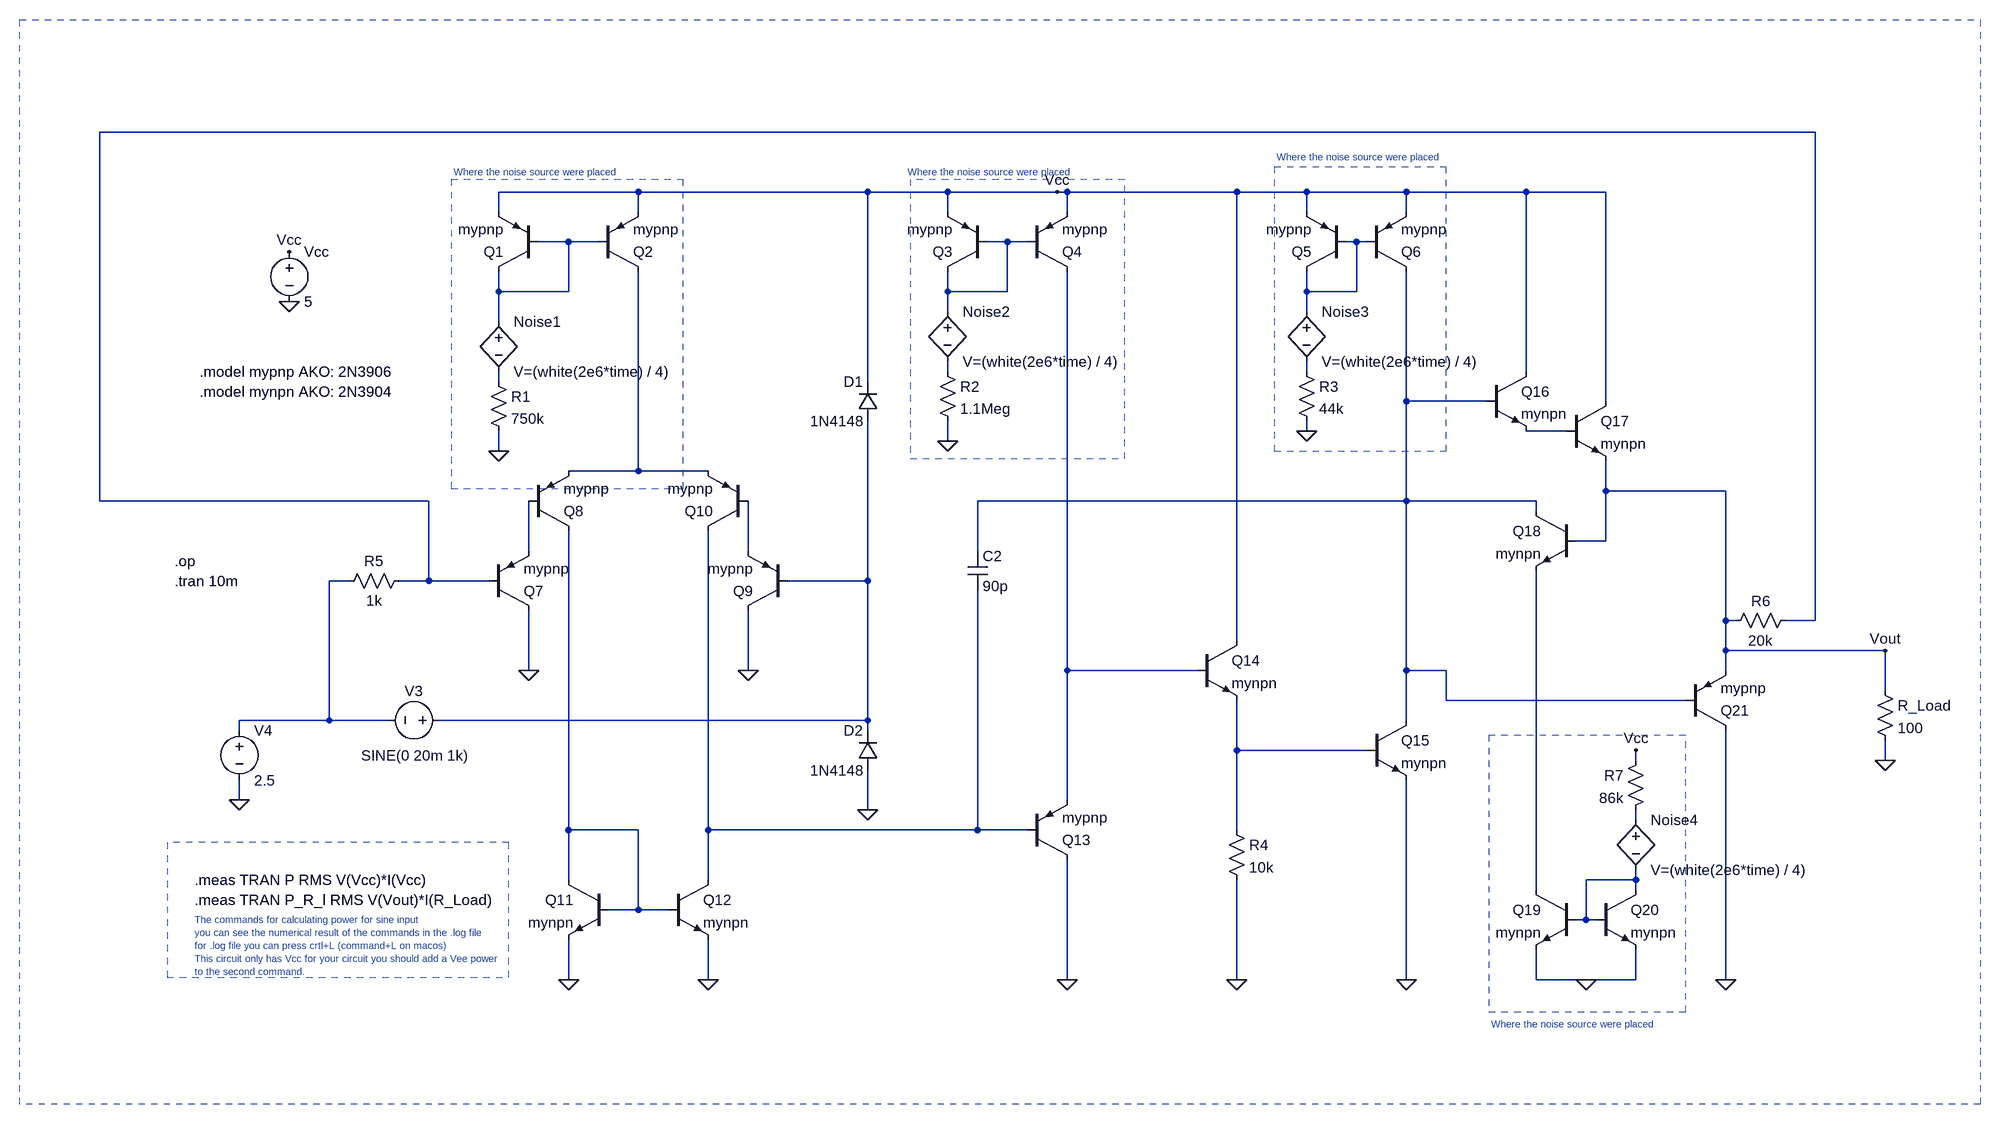
[diagram p0: schematic Noise&Power_Example.asc]
Noise&Power_Example.asc, the LTspice schematic file:
Version 4
SHEET 1 2320 1292
WIRE 1552 -272 -1200 -272
WIRE -336 -176 -560 -176
WIRE 32 -176 -336 -176
WIRE 160 -176 32 -176
WIRE 336 -176 160 -176
WIRE 352 -176 336 -176
WIRE 624 -176 352 -176
WIRE 736 -176 624 -176
WIRE 896 -176 736 -176
WIRE 1088 -176 896 -176
WIRE 1216 -176 1088 -176
WIRE -560 -144 -560 -176
WIRE -336 -144 -336 -176
WIRE 160 -144 160 -176
WIRE 352 -144 352 -176
WIRE 736 -144 736 -176
WIRE 896 -144 896 -176
WIRE -448 -96 -496 -96
WIRE -400 -96 -448 -96
WIRE 256 -96 224 -96
WIRE 288 -96 256 -96
WIRE 816 -96 800 -96
WIRE 832 -96 816 -96
WIRE -560 -16 -560 -48
WIRE -448 -16 -448 -96
WIRE -448 -16 -560 -16
WIRE 160 -16 160 -48
WIRE 256 -16 256 -96
WIRE 256 -16 160 -16
WIRE 736 -16 736 -48
WIRE 816 -16 816 -96
WIRE 816 -16 736 -16
WIRE 160 16 160 -16
WIRE 736 16 736 -16
WIRE -560 32 -560 -16
WIRE 160 112 160 96
WIRE 736 112 736 96
WIRE 1088 112 1088 -176
WIRE -560 128 -560 112
WIRE 32 128 32 -176
WIRE 896 160 896 -48
WIRE 1024 160 896 160
WIRE 1216 160 1216 -176
WIRE 736 208 736 192
WIRE 1152 208 1088 208
WIRE 160 224 160 192
WIRE -560 240 -560 208
WIRE -336 272 -336 -48
WIRE -336 272 -448 272
WIRE -224 272 -336 272
WIRE 1216 304 1216 256
WIRE 1408 304 1216 304
WIRE -1200 320 -1200 -272
WIRE -672 320 -1200 320
WIRE 896 320 896 160
WIRE 896 320 208 320
WIRE 1104 320 896 320
WIRE 1104 336 1104 320
WIRE 1216 384 1216 304
WIRE 1216 384 1168 384
WIRE -512 400 -512 320
WIRE -160 400 -160 320
WIRE 208 400 208 320
WIRE -800 448 -832 448
WIRE -672 448 -672 320
WIRE -672 448 -720 448
WIRE -576 448 -672 448
WIRE 32 448 32 192
WIRE 32 448 -96 448
WIRE 1408 512 1408 304
WIRE 1424 512 1408 512
WIRE 1552 512 1552 -272
WIRE 1552 512 1504 512
WIRE 624 544 624 -176
WIRE 1408 560 1408 512
WIRE 1664 560 1408 560
WIRE -512 592 -512 496
WIRE -160 592 -160 496
WIRE 352 592 352 -48
WIRE 560 592 352 592
WIRE 896 592 896 320
WIRE 960 592 896 592
WIRE 1408 592 1408 560
WIRE 1664 624 1664 560
WIRE 960 640 960 592
WIRE 1344 640 960 640
WIRE -832 672 -832 448
WIRE -832 672 -976 672
WIRE -736 672 -832 672
WIRE 32 672 32 448
WIRE 32 672 -656 672
WIRE 896 672 896 592
WIRE -976 688 -976 672
WIRE 32 688 32 672
WIRE 624 720 624 640
WIRE 832 720 624 720
WIRE 1264 736 1264 720
WIRE 1664 736 1664 704
WIRE -976 800 -976 768
WIRE 352 800 352 592
WIRE 32 816 32 752
WIRE 1264 832 1264 816
WIRE -448 848 -448 368
WIRE -336 848 -448 848
WIRE -224 848 -224 368
WIRE 208 848 208 464
WIRE 208 848 -224 848
WIRE 288 848 208 848
WIRE 624 848 624 720
WIRE -448 928 -448 848
WIRE -224 928 -224 848
WIRE 1264 928 1264 912
WIRE 1264 928 1184 928
WIRE 1104 944 1104 432
WIRE 1264 944 1264 928
WIRE -336 976 -336 848
WIRE -336 976 -384 976
WIRE -288 976 -336 976
WIRE 1184 992 1184 928
WIRE 1184 992 1168 992
WIRE 1200 992 1184 992
WIRE -448 1088 -448 1024
WIRE -224 1088 -224 1024
WIRE 352 1088 352 896
WIRE 624 1088 624 928
WIRE 896 1088 896 768
WIRE 1104 1088 1104 1040
WIRE 1184 1088 1104 1088
WIRE 1264 1088 1264 1040
WIRE 1264 1088 1184 1088
WIRE 1408 1088 1408 688
FLAG -896 0 0
FLAG -896 -80 Vcc
FLAG 336 -176 Vcc
FLAG -560 240 0
FLAG 160 224 0
FLAG 736 208 0
FLAG -512 592 0
FLAG -160 592 0
FLAG -448 1088 0
FLAG -224 1088 0
FLAG 352 1088 0
FLAG 624 1088 0
FLAG 896 1088 0
FLAG 32 816 0
FLAG -976 800 0
FLAG 1264 720 Vcc
FLAG 1184 1088 0
FLAG 1664 736 0
FLAG 1664 560 Vout
FLAG 1408 1088 0
SYMBOL voltage -896 -96 R0
SYMATTR InstName Vcc
SYMATTR Value 5
SYMBOL diode 48 192 R180
WINDOW 0 24 64 Left 2
WINDOW 3 24 0 Left 2
SYMATTR InstName D1
SYMATTR Value 1N4148
SYMBOL pnp -496 -48 R180
SYMATTR InstName Q1
SYMATTR Value mypnp
SYMBOL pnp -400 -48 M180
SYMATTR InstName Q2
SYMATTR Value mypnp
SYMBOL res -576 112 R0
SYMATTR InstName R1
SYMATTR Value 750k
SYMBOL pnp 224 -48 R180
SYMATTR InstName Q3
SYMATTR Value mypnp
SYMBOL pnp 288 -48 M180
SYMATTR InstName Q4
SYMATTR Value mypnp
SYMBOL res 144 96 R0
SYMATTR InstName R2
SYMATTR Value 1.1Meg
SYMBOL pnp 800 -48 R180
SYMATTR InstName Q5
SYMATTR Value mypnp
SYMBOL pnp 832 -48 M180
SYMATTR InstName Q6
SYMATTR Value mypnp
SYMBOL res 720 96 R0
SYMATTR InstName R3
SYMATTR Value 44k
SYMBOL pnp -576 496 M180
SYMATTR InstName Q7
SYMATTR Value mypnp
SYMBOL pnp -512 368 M180
SYMATTR InstName Q8
SYMATTR Value mypnp
SYMBOL pnp -96 496 R180
SYMATTR InstName Q9
SYMATTR Value mypnp
SYMBOL pnp -160 368 R180
SYMATTR InstName Q10
SYMATTR Value mypnp
SYMBOL npn -384 928 M0
SYMATTR InstName Q11
SYMATTR Value mynpn
SYMBOL npn -288 928 R0
SYMATTR InstName Q12
SYMATTR Value mynpn
SYMBOL pnp 288 896 M180
SYMATTR InstName Q13
SYMATTR Value mypnp
SYMBOL npn 560 544 R0
SYMATTR InstName Q14
SYMATTR Value mynpn
SYMBOL res 608 832 R0
SYMATTR InstName R4
SYMATTR Value 10k
SYMBOL npn 832 672 R0
SYMATTR InstName Q15
SYMATTR Value mynpn
SYMBOL diode 48 752 R180
WINDOW 0 24 64 Left 2
WINDOW 3 24 0 Left 2
SYMATTR InstName D2
SYMATTR Value 1N4148
SYMBOL cap 192 400 R0
SYMATTR InstName C2
SYMATTR Value 90p
SYMBOL res -704 432 R90
WINDOW 0 0 56 VBottom 2
WINDOW 3 32 56 VTop 2
SYMATTR InstName R5
SYMATTR Value 1k
SYMBOL res 1520 496 R90
WINDOW 0 0 56 VBottom 2
WINDOW 3 32 56 VTop 2
SYMATTR InstName R6
SYMATTR Value 20k
SYMBOL voltage -640 672 R90
WINDOW 0 -32 56 VBottom 2
WINDOW 3 72 55 VBottom 2
SYMATTR InstName V3
SYMATTR Value SINE(0 20m 1k)
SYMATTR Value2 AC -1m
SYMBOL voltage -976 672 R0
SYMATTR InstName V4
SYMATTR Value 2.5
SYMBOL npn 1024 112 R0
SYMATTR InstName Q16
SYMATTR Value mynpn
SYMBOL npn 1152 160 R0
SYMATTR InstName Q17
SYMATTR Value mynpn
SYMBOL npn 1168 336 M0
SYMATTR InstName Q18
SYMATTR Value mynpn
SYMBOL npn 1168 944 M0
SYMATTR InstName Q19
SYMATTR Value mynpn
SYMBOL npn 1200 944 R0
SYMATTR InstName Q20
SYMATTR Value mynpn
SYMBOL Res 1280 720 M0
SYMATTR InstName R7
SYMATTR Value 86k
SYMBOL pnp 1344 688 M180
SYMATTR InstName Q21
SYMATTR Value mypnp
SYMBOL Res 1648 608 R0
SYMATTR InstName R_Load
SYMATTR Value 100
SYMBOL bv -560 16 R0
SYMATTR InstName Noise1
SYMATTR Value V=(white(2e6*time) / 4)
SYMBOL bv 160 0 R0
SYMATTR InstName Noise2
SYMATTR Value V=(white(2e6*time) / 4)
SYMBOL bv 736 0 R0
SYMATTR InstName Noise3
SYMATTR Value V=(white(2e6*time) / 4)
SYMBOL bv 1264 816 R0
SYMATTR InstName Noise4
SYMATTR Value V=(white(2e6*time) / 4)
TEXT -1040 112 Left 2 !.model mypnp AKO: 2N3906
TEXT -1040 144 Left 2 !.model mynpn AKO: 2N3904
TEXT -1080 416 Left 2 !.op
TEXT -1080 448 Left 2 !.tran 10m
TEXT -1048 928 Left 2 !.meas TRAN P RMS V(Vcc)*I(Vcc)
TEXT -1048 960 Left 2 !.meas TRAN P_R_l RMS V(Vout)*I(R_Load)
TEXT -632 -208 Left 1 ;Where the noise source were placed
TEXT 96 -208 Left 1 ;Where the noise source were placed
TEXT 688 -232 Left 1 ;Where the noise source were placed
TEXT 1032 1160 Left 1 ;Where the noise source were placed
TEXT -1048 992 Left 1 ;The commands for calculating power for sine input\nyou can see the numerical result of the commands in the .log file\nfor .log file you can press crtl+L (command+L on macos)\nThis circuit only has Vcc for your circuit you should add a Vee power\nto the second command.
RECTANGLE Normal 444 -196 100 252 3
RECTANGLE Normal 960 -216 684 240 3
RECTANGLE Normal 1344 696 1028 1140 3
RECTANGLE Normal -264 -196 -636 300 3
RECTANGLE Normal -544 868 -1092 1084 3
RECTANGLE Normal -1328 -452 1816 1288 3

The netlist it stands for:
* Noise&Power_Example.asc
Vcc Vcc 0 5
D1 N014 Vcc 1N4148
Q1 N002 N002 Vcc 0 mypnp
Q2 N010 N002 Vcc 0 mypnp
R1 N007 0 750k
Q3 N003 N003 Vcc 0 mypnp
Q4 N015 N003 Vcc 0 mypnp
R2 N005 0 1.1Meg
Q5 N004 N004 Vcc 0 mypnp
Q6 N008 N004 Vcc 0 mypnp
R3 N006 0 44k
Q7 0 N001 N011 0 mypnp
Q8 N018 N011 N010 0 mypnp
Q9 0 N014 N012 0 mypnp
Q10 N019 N012 N010 0 mypnp
Q11 N018 N018 0 0 mynpn
Q12 N019 N018 0 0 mynpn
Q13 0 N019 N015 0 mypnp
Q14 Vcc N015 N016 0 mynpn
R4 N016 0 10k
Q15 N008 N016 0 0 mynpn
D2 0 N014 1N4148
C2 N008 N019 90p
R5 N001 N013 1k
R6 N001 Vout 20k
V3 N014 N013 SINE(0 20m 1k) AC -1m
V4 N013 0 2.5
Q16 Vcc N008 N009 0 mynpn
Q17 Vcc N009 Vout 0 mynpn
Q18 N008 Vout N021 0 mynpn
Q19 N021 N020 0 0 mynpn
Q20 N020 N020 0 0 mynpn
R7 Vcc N017 86k
Q21 0 N008 Vout 0 mypnp
R_Load Vout 0 100
B§Noise1 N002 N007 V=(white(2e6*time) / 4)
B§Noise2 N003 N005 V=(white(2e6*time) / 4)
B§Noise3 N004 N006 V=(white(2e6*time) / 4)
B§Noise4 N017 N020 V=(white(2e6*time) / 4)
.model D D
.lib standard.dio
.model NPN NPN
.model PNP PNP
.lib standard.bjt
.model mypnp AKO: 2N3906
.model mynpn AKO: 2N3904
.op
.tran 10m
.meas TRAN P RMS V(Vcc)*I(Vcc)
.meas TRAN P_R_l RMS V(Vout)*I(R_Load)
* Where the noise source were placed
* Where the noise source were placed
* Where the noise source were placed
* Where the noise source were placed
* The commands for calculating power for sine input
* you can see the numerical result of the commands in the .log file
* for .log file you can press crtl+L (command+L on macos)
* This circuit only has Vcc for your circuit you should add a Vee power
* to the second command.
.backanno
.end